# EasyEDA Pro project Cat01高低温NI板.eprj, board PCB1
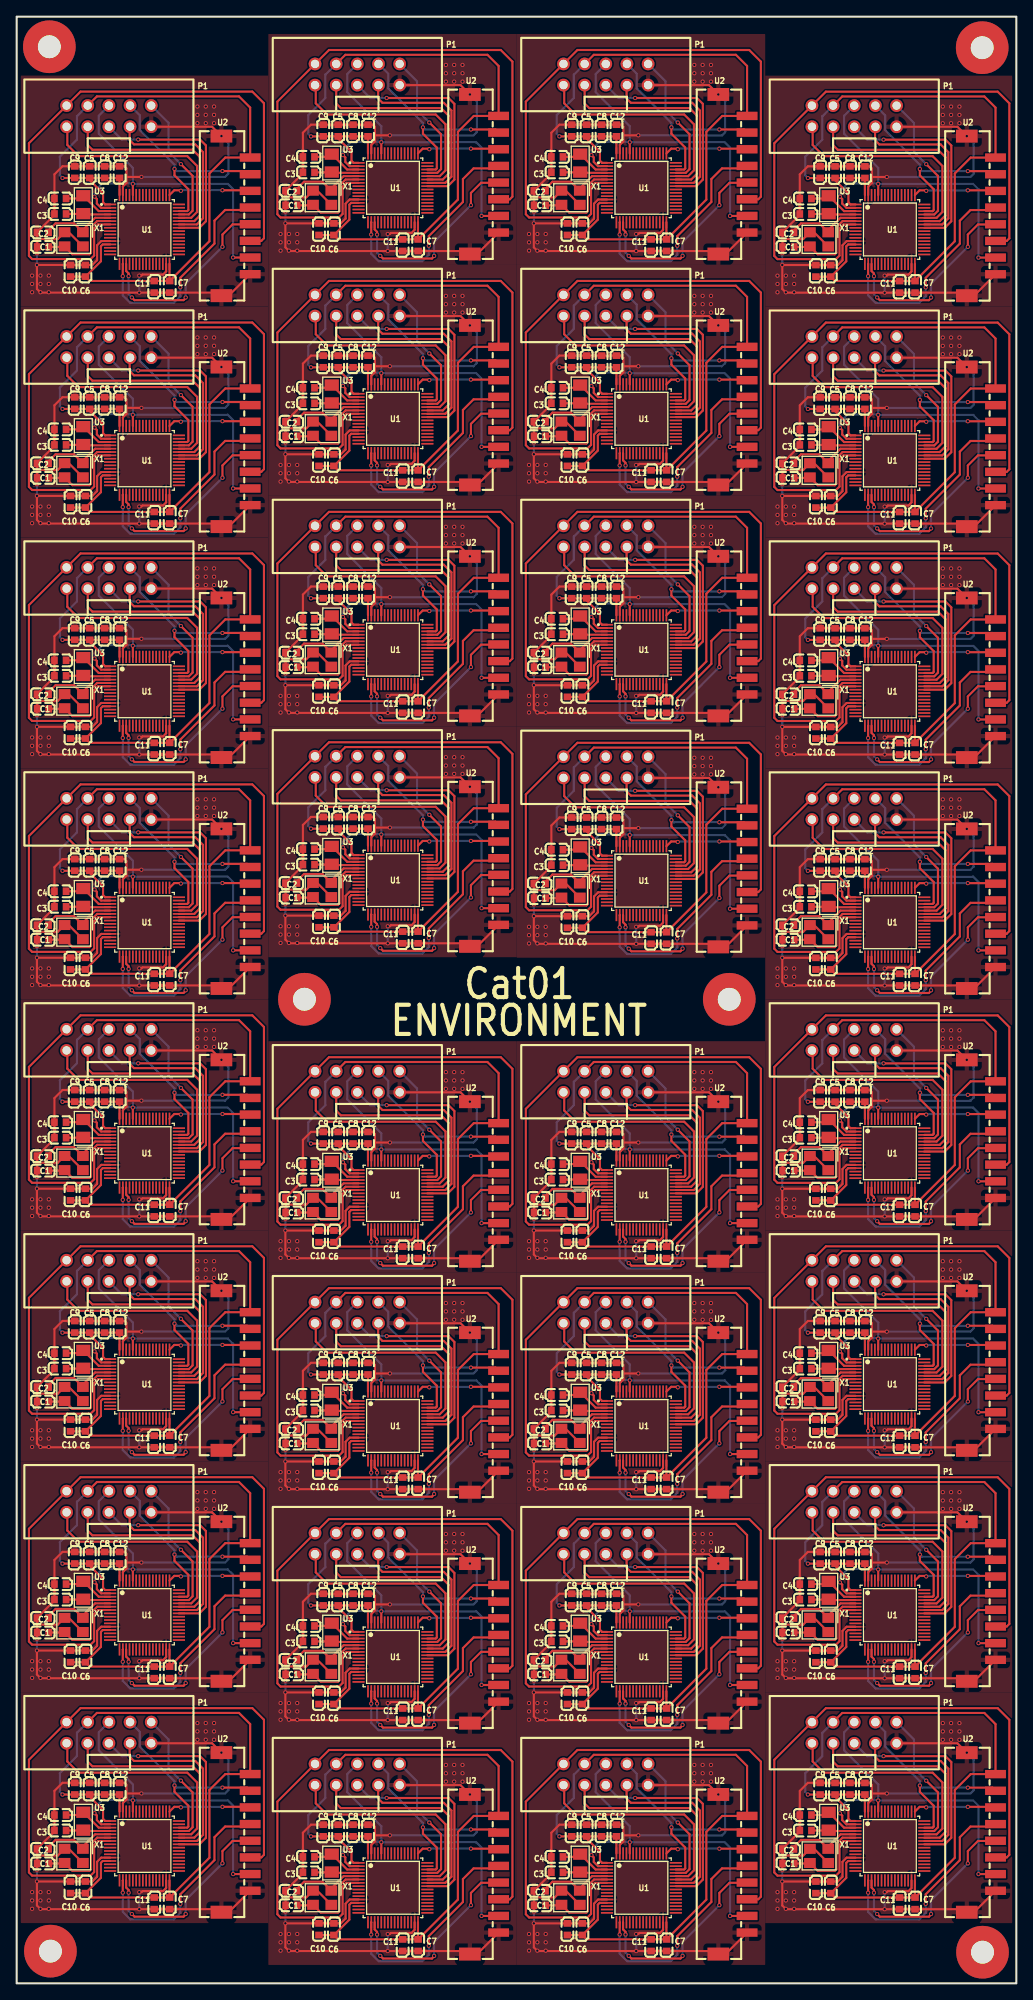
[diagram p1: board, top side]
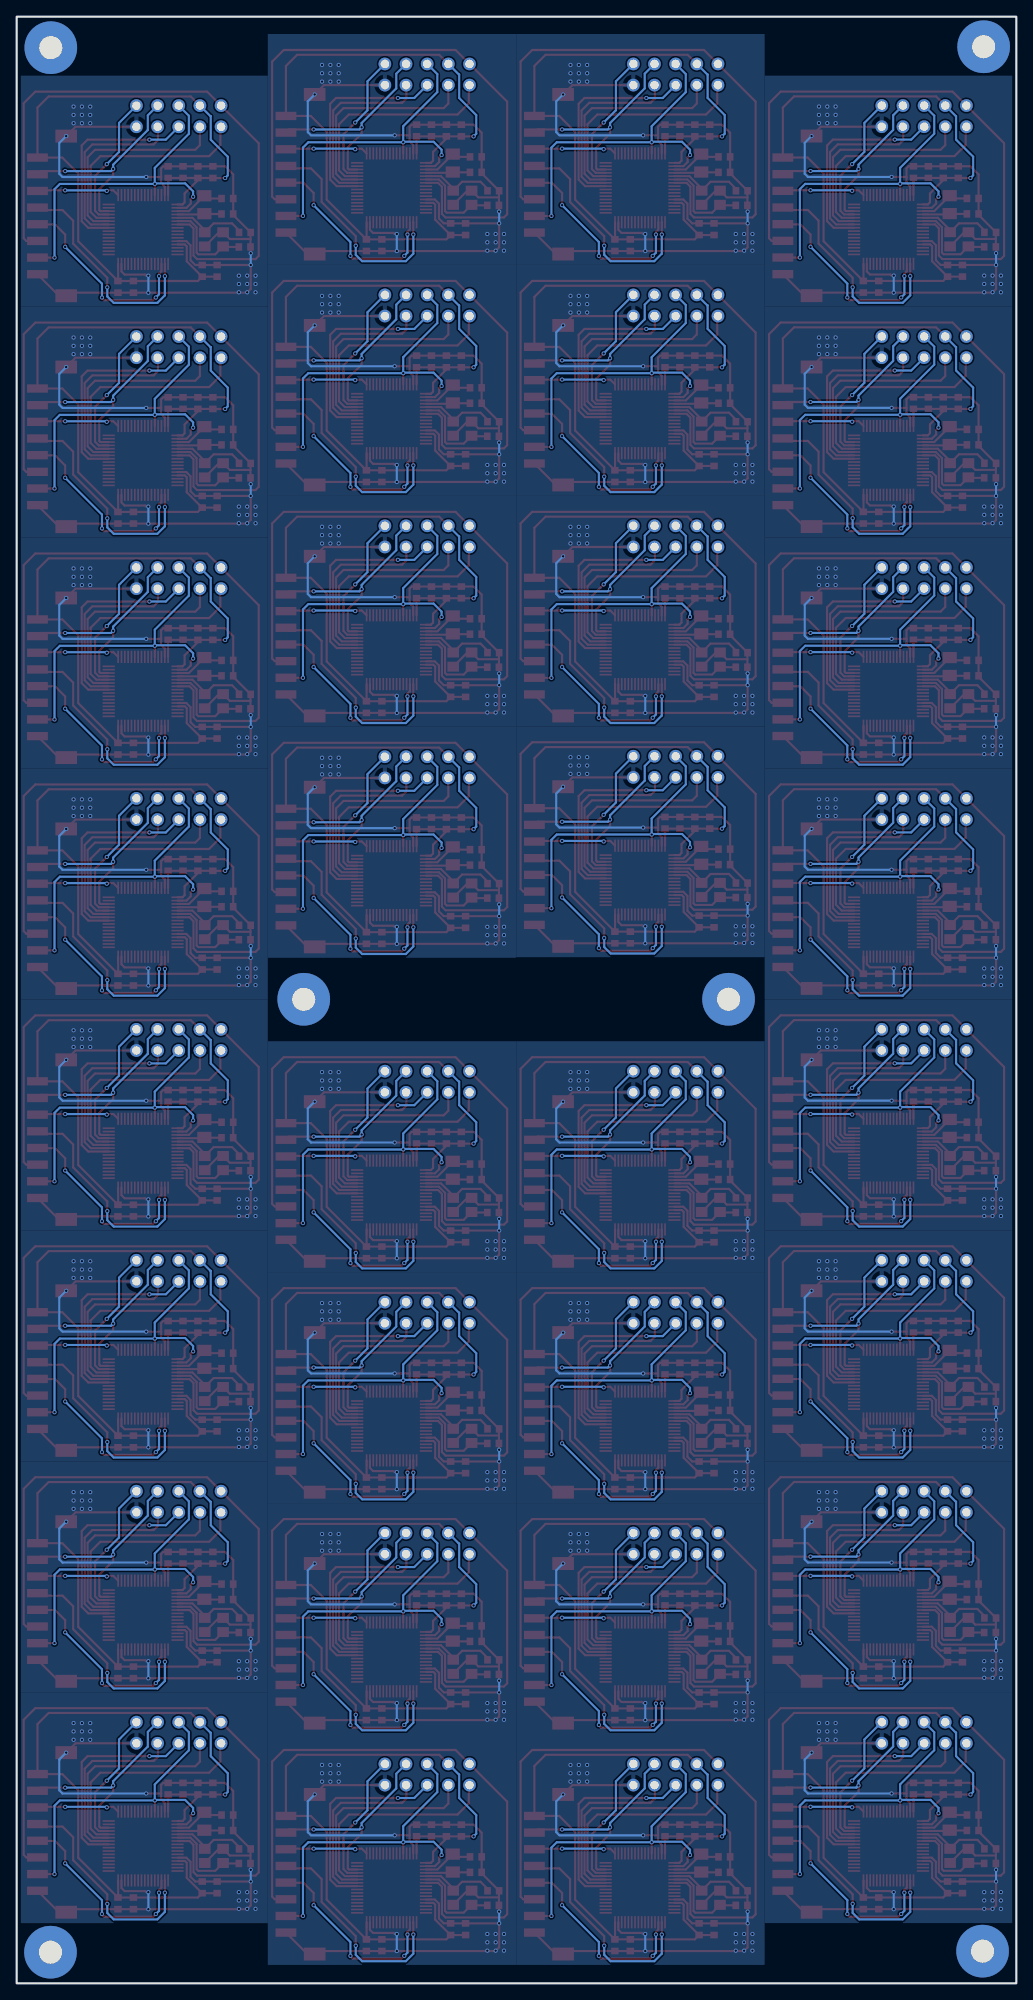
[diagram p2: board, bottom side, seen from below]

Outline 120 x 236 mm; copper layers: Top Layer, Bottom Layer. Coordinates in mm from the lower left corner of the outline.
Outline path: rectangle 0,236 120,0
Stack: Top Layer 0.035mm / Dielectric1 1.51mm FR4 er 4.5 / Bottom Layer 0.035mm

## Design rules (mm)
template: 自定义配置
spacing copperThickness1oz (default): track to track 0.102, other pairs 0.152 to 0.3
spacing copperThickness2oz: track to track 0.203, other pairs 0.152 to 0.3
track width copperThickness1oz (default): min 0.127, default 0.254, max 2.54
track width copperThickness2oz: min 0.203, default 0.254, max 2.54
differential pair differentialPair (default): width min 0.127, default 0.254, max 2.54; gap min 0.152, default 0.152
via viaSize (default): diameter min 0.5, default 0.61, max 10; hole min 0.3, default 0.305, max 6.3

## Placement (name value [footprint] x y rotation side)
C1  12pF  [C0603]  62.81 9.36 0 top
C1#2  -  [C0603]  92.63 208.36 0 top
C1#3  -  [C0603]  92.63 180.65 0 top
C1#4  -  [C0603]  92.63 152.94 0 top
C1#5  -  [C0603]  3.16 180.66 0 top
C1#6  -  [C0603]  92.63 125.23 0 top
C1#7  -  [C0603]  92.63 97.52 0 top
C1#8  -  [C0603]  92.63 69.81 0 top
C1#9  -  [C0603]  92.63 42.09 0 top
C1#10  -  [C0603]  92.63 14.38 0 top
C1#11  -  [C0603]  3.16 152.95 0 top
C1#12  -  [C0603]  3.16 208.37 0 top
C1#13  -  [C0603]  3.16 125.23 0 top
C1#14  -  [C0603]  3.16 97.52 0 top
C1#15  -  [C0603]  3.16 69.81 0 top
C1#16  -  [C0603]  3.16 42.1 0 top
C1#17  -  [C0603]  3.16 14.39 0 top
C1#18  -  [C0603]  32.98 92.5 0 top
C1#19  -  [C0603]  32.98 130.29 0 top
C1#20  -  [C0603]  32.98 64.79 0 top
C1#21  -  [C0603]  32.98 37.07 0 top
C1#22  -  [C0603]  32.98 9.36 0 top
C1#23  -  [C0603]  32.98 213.36 0 top
C1#24  -  [C0603]  32.98 185.65 0 top
C1#25  -  [C0603]  32.98 157.94 0 top
C1#26  -  [C0603]  62.81 213.36 0 top
C1#27  -  [C0603]  62.81 185.65 0 top
C1#28  -  [C0603]  62.81 157.94 0 top
C1#29  -  [C0603]  62.81 130.23 0 top
C1#30  -  [C0603]  62.81 92.5 0 top
C1#31  -  [C0603]  62.81 64.79 0 top
C1#32  -  [C0603]  62.81 37.07 0 top
C2  12pF  [C0603]  62.78 11.1 180 top
C2#2  -  [C0603]  92.61 210.11 180 top
C2#3  -  [C0603]  92.61 182.39 180 top
C2#4  -  [C0603]  92.61 154.68 180 top
C2#5  -  [C0603]  92.61 126.97 180 top
C2#6  -  [C0603]  3.14 182.4 180 top
C2#7  -  [C0603]  92.61 99.26 180 top
C2#8  -  [C0603]  92.61 71.55 180 top
C2#9  -  [C0603]  92.61 43.84 180 top
C2#10  -  [C0603]  92.61 16.12 180 top
C2#11  -  [C0603]  3.14 154.69 180 top
C2#12  -  [C0603]  3.14 210.11 180 top
C2#13  -  [C0603]  3.14 126.98 180 top
C2#14  -  [C0603]  3.14 99.26 180 top
C2#15  -  [C0603]  3.14 71.55 180 top
C2#16  -  [C0603]  3.14 43.84 180 top
C2#17  -  [C0603]  3.14 16.13 180 top
C2#18  -  [C0603]  32.96 94.24 180 top
C2#19  -  [C0603]  32.96 132.03 180 top
C2#20  -  [C0603]  32.96 66.53 180 top
C2#21  -  [C0603]  32.96 38.82 180 top
C2#22  -  [C0603]  32.96 11.1 180 top
C2#23  -  [C0603]  32.96 215.1 180 top
C2#24  -  [C0603]  32.96 187.39 180 top
C2#25  -  [C0603]  32.96 159.68 180 top
C2#26  -  [C0603]  62.78 215.1 180 top
C2#27  -  [C0603]  62.78 187.39 180 top
C2#28  -  [C0603]  62.78 159.68 180 top
C2#29  -  [C0603]  62.78 131.97 180 top
C2#30  -  [C0603]  62.78 94.24 180 top
C2#31  -  [C0603]  62.78 66.53 180 top
C2#32  -  [C0603]  62.78 38.82 180 top
C3  18pF  [C0603]  64.88 13.32 180 top
C3#2  -  [C0603]  94.71 212.32 180 top
C3#3  -  [C0603]  94.71 184.61 180 top
C3#4  -  [C0603]  94.71 156.9 180 top
C3#5  -  [C0603]  5.23 184.62 180 top
C3#6  -  [C0603]  94.71 129.19 180 top
C3#7  -  [C0603]  94.71 101.47 180 top
C3#8  -  [C0603]  94.71 73.76 180 top
C3#9  -  [C0603]  94.71 46.05 180 top
C3#10  -  [C0603]  94.71 18.34 180 top
C3#11  -  [C0603]  5.23 156.9 180 top
C3#12  -  [C0603]  5.23 212.33 180 top
C3#13  -  [C0603]  5.23 129.19 180 top
C3#14  -  [C0603]  5.23 101.48 180 top
C3#15  -  [C0603]  5.23 73.77 180 top
C3#16  -  [C0603]  5.23 46.06 180 top
C3#17  -  [C0603]  5.23 18.34 180 top
C3#18  -  [C0603]  35.06 96.46 180 top
C3#19  -  [C0603]  35.06 134.25 180 top
C3#20  -  [C0603]  35.06 68.74 180 top
C3#21  -  [C0603]  35.06 41.03 180 top
C3#22  -  [C0603]  35.06 13.32 180 top
C3#23  -  [C0603]  35.06 217.32 180 top
C3#24  -  [C0603]  35.06 189.61 180 top
C3#25  -  [C0603]  35.06 161.9 180 top
C3#26  -  [C0603]  64.88 217.32 180 top
C3#27  -  [C0603]  64.88 189.61 180 top
C3#28  -  [C0603]  64.88 161.9 180 top
C3#29  -  [C0603]  64.88 134.18 180 top
C3#30  -  [C0603]  64.88 96.46 180 top
C3#31  -  [C0603]  64.88 68.74 180 top
C3#32  -  [C0603]  64.88 41.03 180 top
C4  18pF  [C0603]  64.88 15.18 180 top
C4#2  -  [C0603]  94.7 214.18 180 top
C4#3  -  [C0603]  94.7 186.47 180 top
C4#4  -  [C0603]  94.7 158.75 180 top
C4#5  -  [C0603]  5.23 186.47 180 top
C4#6  -  [C0603]  94.7 131.04 180 top
C4#7  -  [C0603]  94.7 103.33 180 top
C4#8  -  [C0603]  94.7 75.62 180 top
C4#9  -  [C0603]  94.7 47.91 180 top
C4#10  -  [C0603]  94.7 20.2 180 top
C4#11  -  [C0603]  5.23 158.76 180 top
C4#12  -  [C0603]  5.23 214.18 180 top
C4#13  -  [C0603]  5.23 131.05 180 top
C4#14  -  [C0603]  5.23 103.34 180 top
C4#15  -  [C0603]  5.23 75.62 180 top
C4#16  -  [C0603]  5.23 47.91 180 top
C4#17  -  [C0603]  5.23 20.2 180 top
C4#18  -  [C0603]  35.06 98.31 180 top
C4#19  -  [C0603]  35.06 136.1 180 top
C4#20  -  [C0603]  35.06 70.6 180 top
C4#21  -  [C0603]  35.06 42.89 180 top
C4#22  -  [C0603]  35.06 15.18 180 top
C4#23  -  [C0603]  35.06 219.18 180 top
C4#24  -  [C0603]  35.06 191.46 180 top
C4#25  -  [C0603]  35.06 163.75 180 top
C4#26  -  [C0603]  64.88 219.18 180 top
C4#27  -  [C0603]  64.88 191.46 180 top
C4#28  -  [C0603]  64.88 163.75 180 top
C4#29  -  [C0603]  64.88 136.04 180 top
C4#30  -  [C0603]  64.88 98.31 180 top
C4#31  -  [C0603]  64.88 70.6 180 top
C4#32  -  [C0603]  64.88 42.89 180 top
C5  100nF  [C0603]  8.77 217.34 90 top
C5#2  -  [C0603]  68.42 18.34 90 top
C5#3  -  [C0603]  98.24 217.34 90 top
C5#4  -  [C0603]  8.77 189.63 90 top
C5#5  -  [C0603]  98.24 189.63 90 top
C5#6  -  [C0603]  98.24 161.91 90 top
C5#7  -  [C0603]  98.24 134.2 90 top
C5#8  -  [C0603]  98.24 106.49 90 top
C5#9  -  [C0603]  98.24 78.78 90 top
C5#10  -  [C0603]  98.24 51.07 90 top
C5#11  -  [C0603]  98.24 23.36 90 top
C5#12  -  [C0603]  8.77 161.92 90 top
C5#13  -  [C0603]  8.77 134.21 90 top
C5#14  -  [C0603]  8.77 106.5 90 top
C5#15  -  [C0603]  8.77 78.78 90 top
C5#16  -  [C0603]  8.77 51.07 90 top
C5#17  -  [C0603]  8.77 23.36 90 top
C5#18  -  [C0603]  38.59 101.47 90 top
C5#19  -  [C0603]  38.59 139.26 90 top
C5#20  -  [C0603]  38.59 73.76 90 top
C5#21  -  [C0603]  38.59 46.05 90 top
C5#22  -  [C0603]  38.59 18.34 90 top
C5#23  -  [C0603]  38.59 222.34 90 top
C5#24  -  [C0603]  38.59 194.62 90 top
C5#25  -  [C0603]  38.59 166.91 90 top
C5#26  -  [C0603]  68.42 222.34 90 top
C5#27  -  [C0603]  68.42 194.62 90 top
C5#28  -  [C0603]  68.42 166.91 90 top
C5#29  -  [C0603]  68.42 139.2 90 top
C5#30  -  [C0603]  68.42 101.47 90 top
C5#31  -  [C0603]  68.42 73.76 90 top
C5#32  -  [C0603]  68.42 46.05 90 top
C6  100nF  [C0603]  8.26 205.5 270 top
C6#2  -  [C0603]  67.9 6.5 270 top
C6#3  -  [C0603]  97.73 205.5 270 top
C6#4  -  [C0603]  97.73 177.79 270 top
C6#5  -  [C0603]  97.73 150.07 270 top
C6#6  -  [C0603]  97.73 122.36 270 top
C6#7  -  [C0603]  97.73 94.65 270 top
C6#8  -  [C0603]  8.26 177.79 270 top
C6#9  -  [C0603]  97.73 66.94 270 top
C6#10  -  [C0603]  97.73 39.23 270 top
C6#11  -  [C0603]  97.73 11.52 270 top
C6#12  -  [C0603]  8.26 150.08 270 top
C6#13  -  [C0603]  8.26 122.37 270 top
C6#14  -  [C0603]  8.26 94.66 270 top
C6#15  -  [C0603]  8.26 66.94 270 top
C6#16  -  [C0603]  8.26 39.23 270 top
C6#17  -  [C0603]  8.26 11.52 270 top
C6#18  -  [C0603]  38.08 89.63 270 top
C6#19  -  [C0603]  38.08 127.42 270 top
C6#20  -  [C0603]  38.08 61.92 270 top
C6#21  -  [C0603]  38.08 34.21 270 top
C6#22  -  [C0603]  38.08 6.5 270 top
C6#23  -  [C0603]  38.08 210.5 270 top
C6#24  -  [C0603]  38.08 182.78 270 top
C6#25  -  [C0603]  38.08 155.07 270 top
C6#26  -  [C0603]  67.9 210.5 270 top
C6#27  -  [C0603]  67.9 182.78 270 top
C6#28  -  [C0603]  67.9 155.07 270 top
C6#29  -  [C0603]  67.9 127.36 270 top
C6#30  -  [C0603]  67.9 89.63 270 top
C6#31  -  [C0603]  67.9 61.92 270 top
C6#32  -  [C0603]  67.9 34.21 270 top
C7  100nF  [C0603]  18.37 92.74 270 top
C7#2  -  [C0603]  78.02 4.58 270 top
C7#3  -  [C0603]  107.84 203.58 270 top
C7#4  -  [C0603]  107.84 175.87 270 top
C7#5  -  [C0603]  107.84 148.15 270 top
C7#6  -  [C0603]  107.84 120.44 270 top
C7#7  -  [C0603]  107.84 92.73 270 top
C7#8  -  [C0603]  107.84 65.02 270 top
C7#9  -  [C0603]  107.84 37.31 270 top
C7#10  -  [C0603]  107.84 9.6 270 top
C7#11  -  [C0603]  18.37 148.16 270 top
C7#12  -  [C0603]  18.37 203.58 270 top
C7#13  -  [C0603]  18.37 120.45 270 top
C7#14  -  [C0603]  18.37 65.02 270 top
C7#15  -  [C0603]  18.37 37.31 270 top
C7#16  -  [C0603]  18.37 9.6 270 top
C7#17  -  [C0603]  48.19 87.71 270 top
C7#18  -  [C0603]  48.19 125.5 270 top
C7#19  -  [C0603]  48.19 60 270 top
C7#20  -  [C0603]  48.19 32.29 270 top
C7#21  -  [C0603]  48.19 4.58 270 top
C7#22  -  [C0603]  48.19 208.58 270 top
C7#23  -  [C0603]  48.19 180.86 270 top
C7#24  -  [C0603]  48.19 153.15 270 top
C7#25  -  [C0603]  78.02 208.58 270 top
C7#26  -  [C0603]  78.02 180.86 270 top
C7#27  -  [C0603]  78.02 153.15 270 top
C7#28  -  [C0603]  78.02 125.44 270 top
C7#29  -  [C0603]  78.02 87.71 270 top
C7#30  -  [C0603]  78.02 60 270 top
C7#31  -  [C0603]  18.37 175.87 270 top
C7#32  -  [C0603]  78.02 32.29 270 top
C8  100nF  [C0603]  70.21 18.34 270 top
C8#2  -  [C0603]  100.03 217.34 270 top
C8#3  -  [C0603]  100.03 189.63 270 top
C8#4  -  [C0603]  100.03 161.91 270 top
C8#5  -  [C0603]  100.03 134.2 270 top
C8#6  -  [C0603]  10.56 189.63 270 top
C8#7  -  [C0603]  100.03 106.49 270 top
C8#8  -  [C0603]  100.03 78.78 270 top
C8#9  -  [C0603]  100.03 51.07 270 top
C8#10  -  [C0603]  100.03 23.36 270 top
C8#11  -  [C0603]  10.56 161.92 270 top
C8#12  -  [C0603]  10.56 217.34 270 top
C8#13  -  [C0603]  10.56 134.21 270 top
C8#14  -  [C0603]  10.56 106.5 270 top
C8#15  -  [C0603]  10.56 78.78 270 top
C8#16  -  [C0603]  10.56 51.07 270 top
C8#17  -  [C0603]  10.56 23.36 270 top
C8#18  -  [C0603]  40.38 101.47 270 top
C8#19  -  [C0603]  40.38 139.26 270 top
C8#20  -  [C0603]  40.38 73.76 270 top
C8#21  -  [C0603]  40.38 46.05 270 top
C8#22  -  [C0603]  40.38 18.34 270 top
C8#23  -  [C0603]  40.38 222.34 270 top
C8#24  -  [C0603]  40.38 194.62 270 top
C8#25  -  [C0603]  40.38 166.91 270 top
C8#26  -  [C0603]  70.21 222.34 270 top
C8#27  -  [C0603]  70.21 194.62 270 top
C8#28  -  [C0603]  70.21 166.91 270 top
C8#29  -  [C0603]  70.21 139.2 270 top
C8#30  -  [C0603]  70.21 101.47 270 top
C8#31  -  [C0603]  70.21 73.76 270 top
C8#32  -  [C0603]  70.21 46.05 270 top
C9  10uF  [C0603]  66.62 18.34 90 top
C9#2  -  [C0603]  96.45 217.34 90 top
C9#3  -  [C0603]  96.45 189.63 90 top
C9#4  -  [C0603]  6.98 189.63 90 top
C9#5  -  [C0603]  96.45 161.91 90 top
C9#6  -  [C0603]  96.45 134.2 90 top
C9#7  -  [C0603]  96.45 106.49 90 top
C9#8  -  [C0603]  96.45 78.78 90 top
C9#9  -  [C0603]  96.45 51.07 90 top
C9#10  -  [C0603]  96.45 23.36 90 top
C9#11  -  [C0603]  6.98 161.92 90 top
C9#12  -  [C0603]  6.98 217.34 90 top
C9#13  -  [C0603]  6.98 134.21 90 top
C9#14  -  [C0603]  6.98 106.5 90 top
C9#15  -  [C0603]  6.98 78.78 90 top
C9#16  -  [C0603]  6.98 51.07 90 top
C9#17  -  [C0603]  6.98 23.36 90 top
C9#18  -  [C0603]  36.8 101.47 90 top
C9#19  -  [C0603]  36.8 139.26 90 top
C9#20  -  [C0603]  36.8 73.76 90 top
C9#21  -  [C0603]  36.8 46.05 90 top
C9#22  -  [C0603]  36.8 18.34 90 top
C9#23  -  [C0603]  36.8 222.34 90 top
C9#24  -  [C0603]  36.8 194.62 90 top
C9#25  -  [C0603]  36.8 166.91 90 top
C9#26  -  [C0603]  66.62 222.34 90 top
C9#27  -  [C0603]  66.62 194.62 90 top
C9#28  -  [C0603]  66.62 166.91 90 top
C9#29  -  [C0603]  66.62 139.2 90 top
C9#30  -  [C0603]  66.62 101.47 90 top
C9#31  -  [C0603]  66.62 73.76 90 top
C9#32  -  [C0603]  66.62 46.05 90 top
C10  10uF  [C0603]  66.11 6.5 270 top
C10#2  -  [C0603]  95.94 205.5 270 top
C10#3  -  [C0603]  95.94 177.79 270 top
C10#4  -  [C0603]  95.94 150.07 270 top
C10#5  -  [C0603]  95.94 122.36 270 top
C10#6  -  [C0603]  95.94 94.65 270 top
C10#7  -  [C0603]  6.46 177.79 270 top
C10#8  -  [C0603]  95.94 66.94 270 top
C10#9  -  [C0603]  95.94 39.23 270 top
C10#10  -  [C0603]  95.94 11.52 270 top
C10#11  -  [C0603]  6.46 205.5 270 top
C10#12  -  [C0603]  6.46 150.08 270 top
C10#13  -  [C0603]  6.46 122.37 270 top
C10#14  -  [C0603]  6.46 94.66 270 top
C10#15  -  [C0603]  6.46 66.94 270 top
C10#16  -  [C0603]  6.46 39.23 270 top
C10#17  -  [C0603]  6.46 11.52 270 top
C10#18  -  [C0603]  36.29 89.63 270 top
C10#19  -  [C0603]  36.29 127.42 270 top
C10#20  -  [C0603]  36.29 61.92 270 top
C10#21  -  [C0603]  36.29 34.21 270 top
C10#22  -  [C0603]  36.29 6.5 270 top
C10#23  -  [C0603]  36.29 210.5 270 top
C10#24  -  [C0603]  36.29 182.78 270 top
C10#25  -  [C0603]  36.29 155.07 270 top
C10#26  -  [C0603]  66.11 210.5 270 top
C10#27  -  [C0603]  66.11 182.78 270 top
C10#28  -  [C0603]  66.11 155.07 270 top
C10#29  -  [C0603]  66.11 127.36 270 top
C10#30  -  [C0603]  66.11 89.63 270 top
C10#31  -  [C0603]  66.11 61.92 270 top
C10#32  -  [C0603]  66.11 34.21 270 top
C11  10uF  [C0603]  16.51 92.74 270 top
C11#2  -  [C0603]  76.16 4.58 270 top
C11#3  -  [C0603]  105.98 203.58 270 top
C11#4  -  [C0603]  105.98 175.87 270 top
C11#5  -  [C0603]  105.98 148.15 270 top
C11#6  -  [C0603]  105.98 120.44 270 top
C11#7  -  [C0603]  105.98 92.73 270 top
C11#8  -  [C0603]  105.98 65.02 270 top
C11#9  -  [C0603]  105.98 37.31 270 top
C11#10  -  [C0603]  105.98 9.6 270 top
C11#11  -  [C0603]  16.51 148.16 270 top
C11#12  -  [C0603]  16.51 203.58 270 top
C11#13  -  [C0603]  16.51 120.45 270 top
C11#14  -  [C0603]  16.51 65.02 270 top
C11#15  -  [C0603]  16.51 37.31 270 top
C11#16  -  [C0603]  16.51 9.6 270 top
C11#17  -  [C0603]  46.34 87.71 270 top
C11#18  -  [C0603]  46.34 125.5 270 top
C11#19  -  [C0603]  46.34 60 270 top
C11#20  -  [C0603]  46.34 32.29 270 top
C11#21  -  [C0603]  46.34 4.58 270 top
C11#22  -  [C0603]  46.34 208.58 270 top
C11#23  -  [C0603]  46.34 180.86 270 top
C11#24  -  [C0603]  46.34 153.15 270 top
C11#25  -  [C0603]  76.16 208.58 270 top
C11#26  -  [C0603]  76.16 180.86 270 top
C11#27  -  [C0603]  76.16 153.15 270 top
C11#28  -  [C0603]  76.16 125.44 270 top
C11#29  -  [C0603]  76.16 87.71 270 top
C11#30  -  [C0603]  76.16 60 270 top
C11#31  -  [C0603]  16.51 175.87 270 top
C11#32  -  [C0603]  76.16 32.29 270 top
C12  10uF  [C0603]  72 18.34 270 top
C12#2  -  [C0603]  101.82 217.34 270 top
C12#3  -  [C0603]  101.82 189.63 270 top
C12#4  -  [C0603]  101.82 161.91 270 top
C12#5  -  [C0603]  101.82 134.2 270 top
C12#6  -  [C0603]  12.35 189.63 270 top
C12#7  -  [C0603]  101.82 106.49 270 top
C12#8  -  [C0603]  101.82 78.78 270 top
C12#9  -  [C0603]  101.82 51.07 270 top
C12#10  -  [C0603]  101.82 23.36 270 top
C12#11  -  [C0603]  12.35 217.34 270 top
C12#12  -  [C0603]  12.35 161.92 270 top
C12#13  -  [C0603]  12.35 134.21 270 top
C12#14  -  [C0603]  12.35 106.5 270 top
C12#15  -  [C0603]  12.35 78.78 270 top
C12#16  -  [C0603]  12.35 51.07 270 top
C12#17  -  [C0603]  12.35 23.36 270 top
C12#18  -  [C0603]  42.18 101.47 270 top
C12#19  -  [C0603]  42.18 139.26 270 top
C12#20  -  [C0603]  42.18 73.76 270 top
C12#21  -  [C0603]  42.18 46.05 270 top
C12#22  -  [C0603]  42.18 18.34 270 top
C12#23  -  [C0603]  42.18 222.34 270 top
C12#24  -  [C0603]  42.18 194.62 270 top
C12#25  -  [C0603]  42.18 166.91 270 top
C12#26  -  [C0603]  72 222.34 270 top
C12#27  -  [C0603]  72 194.62 270 top
C12#28  -  [C0603]  72 166.91 270 top
C12#29  -  [C0603]  72 139.2 270 top
C12#30  -  [C0603]  72 101.47 270 top
C12#31  -  [C0603]  72 73.76 270 top
C12#32  -  [C0603]  72 46.05 270 top
J1  -  [demo板安装孔]  34.55 118.09 0 top
J2  -  [demo板安装孔]  85.54 118.09 0 top
J3  -  [demo板安装孔]  3.92 232.39 0 top
J4  -  [demo板安装孔]  115.9 232.28 0 top
J5  -  [demo板安装孔]  115.94 3.73 0 top
J6  -  [demo板安装孔]  4.05 3.86 0 top
P1  2.54-2*5P简牛  [IDC-TH_10P-P2.54_C5665]  11.07 113.22 0 top
P1#2  -  [IDC-TH_10P-P2.54_C5665]  70.72 25.06 0 top
P1#3  -  [IDC-TH_10P-P2.54_C5665]  100.54 224.06 0 top
P1#4  -  [IDC-TH_10P-P2.54_C5665]  100.54 196.35 0 top
P1#5  -  [IDC-TH_10P-P2.54_C5665]  100.54 168.63 0 top
P1#6  -  [IDC-TH_10P-P2.54_C5665]  100.54 140.92 0 top
P1#7  -  [IDC-TH_10P-P2.54_C5665]  100.54 113.21 0 top
P1#8  -  [IDC-TH_10P-P2.54_C5665]  100.54 85.5 0 top
P1#9  -  [IDC-TH_10P-P2.54_C5665]  100.54 57.79 0 top
P1#10  -  [IDC-TH_10P-P2.54_C5665]  100.54 30.08 0 top
P1#11  -  [IDC-TH_10P-P2.54_C5665]  11.07 168.64 0 top
P1#12  -  [IDC-TH_10P-P2.54_C5665]  11.07 224.06 0 top
P1#13  -  [IDC-TH_10P-P2.54_C5665]  11.07 140.93 0 top
P1#14  -  [IDC-TH_10P-P2.54_C5665]  11.07 85.5 0 top
P1#15  -  [IDC-TH_10P-P2.54_C5665]  11.07 57.79 0 top
P1#16  -  [IDC-TH_10P-P2.54_C5665]  11.07 30.08 0 top
P1#17  -  [IDC-TH_10P-P2.54_C5665]  40.9 108.19 0 top
P1#18  -  [IDC-TH_10P-P2.54_C5665]  40.9 145.98 0 top
P1#19  -  [IDC-TH_10P-P2.54_C5665]  40.9 80.48 0 top
P1#20  -  [IDC-TH_10P-P2.54_C5665]  40.9 52.77 0 top
P1#21  -  [IDC-TH_10P-P2.54_C5665]  40.9 25.06 0 top
P1#22  -  [IDC-TH_10P-P2.54_C5665]  40.9 229.06 0 top
P1#23  -  [IDC-TH_10P-P2.54_C5665]  40.9 201.34 0 top
P1#24  -  [IDC-TH_10P-P2.54_C5665]  40.9 173.63 0 top
P1#25  -  [IDC-TH_10P-P2.54_C5665]  70.72 229.06 0 top
P1#26  -  [IDC-TH_10P-P2.54_C5665]  70.72 201.34 0 top
P1#27  -  [IDC-TH_10P-P2.54_C5665]  70.72 173.63 0 top
P1#28  -  [IDC-TH_10P-P2.54_C5665]  70.72 145.92 0 top
P1#29  -  [IDC-TH_10P-P2.54_C5665]  70.72 108.19 0 top
P1#30  -  [IDC-TH_10P-P2.54_C5665]  70.72 80.48 0 top
P1#31  -  [IDC-TH_10P-P2.54_C5665]  70.72 52.77 0 top
P1#32  -  [IDC-TH_10P-P2.54_C5665]  11.07 196.35 0 top
U1  -  [LQFP-64_L7.0-W7.0-P0.40-LS9.0-TL]  75 11.46 0 top
U1#2  -  [LQFP-64_L7.0-W7.0-P0.40-LS9.0-TL]  104.82 210.46 0 top
U1#3  -  [LQFP-64_L7.0-W7.0-P0.40-LS9.0-TL]  104.82 182.75 0 top
U1#4  -  [LQFP-64_L7.0-W7.0-P0.40-LS9.0-TL]  15.35 182.76 0 top
U1#5  -  [LQFP-64_L7.0-W7.0-P0.40-LS9.0-TL]  104.82 155.04 0 top
U1#6  -  [LQFP-64_L7.0-W7.0-P0.40-LS9.0-TL]  104.82 127.33 0 top
U1#7  -  [LQFP-64_L7.0-W7.0-P0.40-LS9.0-TL]  104.82 99.61 0 top
U1#8  -  [LQFP-64_L7.0-W7.0-P0.40-LS9.0-TL]  104.82 71.9 0 top
U1#9  -  [LQFP-64_L7.0-W7.0-P0.40-LS9.0-TL]  15.35 44.2 0 top
U1#10  -  [LQFP-64_L7.0-W7.0-P0.40-LS9.0-TL]  104.82 44.19 0 top
U1#11  -  [LQFP-64_L7.0-W7.0-P0.40-LS9.0-TL]  104.82 16.48 0 top
U1#12  -  [LQFP-64_L7.0-W7.0-P0.40-LS9.0-TL]  15.35 155.04 0 top
U1#13  -  [LQFP-64_L7.0-W7.0-P0.40-LS9.0-TL]  15.35 210.47 0 top
U1#14  -  [LQFP-64_L7.0-W7.0-P0.40-LS9.0-TL]  15.35 127.33 0 top
U1#15  -  [LQFP-64_L7.0-W7.0-P0.40-LS9.0-TL]  15.35 99.62 0 top
U1#16  -  [LQFP-64_L7.0-W7.0-P0.40-LS9.0-TL]  15.35 71.91 0 top
U1#17  -  [LQFP-64_L7.0-W7.0-P0.40-LS9.0-TL]  15.35 16.48 0 top
U1#18  -  [LQFP-64_L7.0-W7.0-P0.40-LS9.0-TL]  45.17 94.6 0 top
U1#19  -  [LQFP-64_L7.0-W7.0-P0.40-LS9.0-TL]  45.17 132.39 0 top
U1#20  -  [LQFP-64_L7.0-W7.0-P0.40-LS9.0-TL]  45.17 66.88 0 top
U1#21  -  [LQFP-64_L7.0-W7.0-P0.40-LS9.0-TL]  45.17 39.17 0 top
U1#22  -  [LQFP-64_L7.0-W7.0-P0.40-LS9.0-TL]  45.17 11.46 0 top
U1#23  -  [LQFP-64_L7.0-W7.0-P0.40-LS9.0-TL]  45.17 215.46 0 top
U1#24  -  [LQFP-64_L7.0-W7.0-P0.40-LS9.0-TL]  45.17 187.75 0 top
U1#25  -  [LQFP-64_L7.0-W7.0-P0.40-LS9.0-TL]  45.17 160.04 0 top
U1#26  -  [LQFP-64_L7.0-W7.0-P0.40-LS9.0-TL]  75 215.46 0 top
U1#27  -  [LQFP-64_L7.0-W7.0-P0.40-LS9.0-TL]  75 187.75 0 top
U1#28  -  [LQFP-64_L7.0-W7.0-P0.40-LS9.0-TL]  75 160.04 0 top
U1#29  -  [LQFP-64_L7.0-W7.0-P0.40-LS9.0-TL]  75 132.32 0 top
U1#30  -  [LQFP-64_L7.0-W7.0-P0.40-LS9.0-TL]  75 94.6 0 top
U1#31  -  [LQFP-64_L7.0-W7.0-P0.40-LS9.0-TL]  75 66.88 0 top
U1#32  -  [LQFP-64_L7.0-W7.0-P0.40-LS9.0-TL]  75 39.17 0 top
U2  A2008WV-S-8P  [CONN-SMD_A2008WV-S-8P]  26.3 184.38 270 top
U2#2  -  [CONN-SMD_A2008WV-S-8P]  85.95 13.09 270 top
U2#3  -  [CONN-SMD_A2008WV-S-8P]  115.78 212.09 270 top
U2#4  -  [CONN-SMD_A2008WV-S-8P]  115.78 184.38 270 top
U2#5  -  [CONN-SMD_A2008WV-S-8P]  115.78 156.67 270 top
U2#6  -  [CONN-SMD_A2008WV-S-8P]  115.78 128.95 270 top
U2#7  -  [CONN-SMD_A2008WV-S-8P]  115.78 101.24 270 top
U2#8  -  [CONN-SMD_A2008WV-S-8P]  115.78 73.53 270 top
U2#9  -  [CONN-SMD_A2008WV-S-8P]  115.78 45.82 270 top
U2#10  -  [CONN-SMD_A2008WV-S-8P]  115.78 18.11 270 top
U2#11  -  [CONN-SMD_A2008WV-S-8P]  26.3 156.67 270 top
U2#12  -  [CONN-SMD_A2008WV-S-8P]  26.3 212.1 270 top
U2#13  -  [CONN-SMD_A2008WV-S-8P]  26.3 128.96 270 top
U2#14  -  [CONN-SMD_A2008WV-S-8P]  26.3 101.25 270 top
U2#15  -  [CONN-SMD_A2008WV-S-8P]  26.3 73.54 270 top
U2#16  -  [CONN-SMD_A2008WV-S-8P]  26.3 45.82 270 top
U2#17  -  [CONN-SMD_A2008WV-S-8P]  26.3 18.11 270 top
U2#18  -  [CONN-SMD_A2008WV-S-8P]  56.13 96.22 270 top
U2#19  -  [CONN-SMD_A2008WV-S-8P]  56.13 134.02 270 top
U2#20  -  [CONN-SMD_A2008WV-S-8P]  56.13 68.51 270 top
U2#21  -  [CONN-SMD_A2008WV-S-8P]  56.13 40.8 270 top
U2#22  -  [CONN-SMD_A2008WV-S-8P]  56.13 13.09 270 top
U2#23  -  [CONN-SMD_A2008WV-S-8P]  56.13 217.09 270 top
U2#24  -  [CONN-SMD_A2008WV-S-8P]  56.13 189.38 270 top
U2#25  -  [CONN-SMD_A2008WV-S-8P]  56.13 161.66 270 top
U2#26  -  [CONN-SMD_A2008WV-S-8P]  85.95 217.09 270 top
U2#27  -  [CONN-SMD_A2008WV-S-8P]  85.95 189.38 270 top
U2#28  -  [CONN-SMD_A2008WV-S-8P]  85.95 161.66 270 top
U2#29  -  [CONN-SMD_A2008WV-S-8P]  85.95 133.95 270 top
U2#30  -  [CONN-SMD_A2008WV-S-8P]  85.95 96.22 270 top
U2#31  -  [CONN-SMD_A2008WV-S-8P]  85.95 68.51 270 top
U2#32  -  [CONN-SMD_A2008WV-S-8P]  85.95 40.8 270 top
U3  32.768kHz  [CRYSTAL-SMD_L3.2-W1.5-3]  67.65 14.43 270 top
U3#2  -  [CRYSTAL-SMD_L3.2-W1.5-3]  97.47 213.43 270 top
U3#3  -  [CRYSTAL-SMD_L3.2-W1.5-3]  97.47 185.72 270 top
U3#4  -  [CRYSTAL-SMD_L3.2-W1.5-3]  97.47 158.01 270 top
U3#5  -  [CRYSTAL-SMD_L3.2-W1.5-3]  8 185.73 270 top
U3#6  -  [CRYSTAL-SMD_L3.2-W1.5-3]  97.47 130.3 270 top
U3#7  -  [CRYSTAL-SMD_L3.2-W1.5-3]  97.47 102.59 270 top
U3#8  -  [CRYSTAL-SMD_L3.2-W1.5-3]  97.47 74.88 270 top
U3#9  -  [CRYSTAL-SMD_L3.2-W1.5-3]  97.47 47.16 270 top
U3#10  -  [CRYSTAL-SMD_L3.2-W1.5-3]  97.47 19.45 270 top
U3#11  -  [CRYSTAL-SMD_L3.2-W1.5-3]  8 158.02 270 top
U3#12  -  [CRYSTAL-SMD_L3.2-W1.5-3]  8 213.44 270 top
U3#13  -  [CRYSTAL-SMD_L3.2-W1.5-3]  8 130.3 270 top
U3#14  -  [CRYSTAL-SMD_L3.2-W1.5-3]  8 102.59 270 top
U3#15  -  [CRYSTAL-SMD_L3.2-W1.5-3]  8 74.88 270 top
U3#16  -  [CRYSTAL-SMD_L3.2-W1.5-3]  67.65 42.14 270 top
U3#17  -  [CRYSTAL-SMD_L3.2-W1.5-3]  8 47.17 270 top
U3#18  -  [CRYSTAL-SMD_L3.2-W1.5-3]  8 19.46 270 top
U3#19  -  [CRYSTAL-SMD_L3.2-W1.5-3]  37.82 97.57 270 top
U3#20  -  [CRYSTAL-SMD_L3.2-W1.5-3]  37.82 135.36 270 top
U3#21  -  [CRYSTAL-SMD_L3.2-W1.5-3]  37.82 69.86 270 top
U3#22  -  [CRYSTAL-SMD_L3.2-W1.5-3]  37.82 42.14 270 top
U3#23  -  [CRYSTAL-SMD_L3.2-W1.5-3]  37.82 14.43 270 top
U3#24  -  [CRYSTAL-SMD_L3.2-W1.5-3]  37.82 218.43 270 top
U3#25  -  [CRYSTAL-SMD_L3.2-W1.5-3]  37.82 190.72 270 top
U3#26  -  [CRYSTAL-SMD_L3.2-W1.5-3]  37.82 163.01 270 top
U3#27  -  [CRYSTAL-SMD_L3.2-W1.5-3]  67.65 218.43 270 top
U3#28  -  [CRYSTAL-SMD_L3.2-W1.5-3]  67.65 190.72 270 top
U3#29  -  [CRYSTAL-SMD_L3.2-W1.5-3]  67.65 163.01 270 top
U3#30  -  [CRYSTAL-SMD_L3.2-W1.5-3]  67.65 135.3 270 top
U3#31  -  [CRYSTAL-SMD_L3.2-W1.5-3]  67.65 97.57 270 top
U3#32  -  [CRYSTAL-SMD_L3.2-W1.5-3]  67.65 69.86 270 top
X1  24MHz  [CRYSTAL-SMD_4P-L3.2-W2.5-BL]  6.85 126.14 180 top
X1#2  -  [CRYSTAL-SMD_4P-L3.2-W2.5-BL]  66.5 10.27 180 top
X1#3  -  [CRYSTAL-SMD_4P-L3.2-W2.5-BL]  96.32 209.27 180 top
X1#4  -  [CRYSTAL-SMD_4P-L3.2-W2.5-BL]  96.32 181.56 180 top
X1#5  -  [CRYSTAL-SMD_4P-L3.2-W2.5-BL]  96.32 153.85 180 top
X1#6  -  [CRYSTAL-SMD_4P-L3.2-W2.5-BL]  96.32 126.14 180 top
X1#7  -  [CRYSTAL-SMD_4P-L3.2-W2.5-BL]  96.32 98.43 180 top
X1#8  -  [CRYSTAL-SMD_4P-L3.2-W2.5-BL]  6.85 181.57 180 top
X1#9  -  [CRYSTAL-SMD_4P-L3.2-W2.5-BL]  96.32 70.72 180 top
X1#10  -  [CRYSTAL-SMD_4P-L3.2-W2.5-BL]  96.32 43 180 top
X1#11  -  [CRYSTAL-SMD_4P-L3.2-W2.5-BL]  96.32 15.29 180 top
X1#12  -  [CRYSTAL-SMD_4P-L3.2-W2.5-BL]  6.85 209.28 180 top
X1#13  -  [CRYSTAL-SMD_4P-L3.2-W2.5-BL]  6.85 153.86 180 top
X1#14  -  [CRYSTAL-SMD_4P-L3.2-W2.5-BL]  6.85 98.43 180 top
X1#15  -  [CRYSTAL-SMD_4P-L3.2-W2.5-BL]  6.85 70.72 180 top
X1#16  -  [CRYSTAL-SMD_4P-L3.2-W2.5-BL]  6.85 43.01 180 top
X1#17  -  [CRYSTAL-SMD_4P-L3.2-W2.5-BL]  6.85 15.3 180 top
X1#18  -  [CRYSTAL-SMD_4P-L3.2-W2.5-BL]  36.67 93.41 180 top
X1#19  -  [CRYSTAL-SMD_4P-L3.2-W2.5-BL]  36.67 131.2 180 top
X1#20  -  [CRYSTAL-SMD_4P-L3.2-W2.5-BL]  36.67 65.7 180 top
X1#21  -  [CRYSTAL-SMD_4P-L3.2-W2.5-BL]  36.67 37.98 180 top
X1#22  -  [CRYSTAL-SMD_4P-L3.2-W2.5-BL]  36.67 10.27 180 top
X1#23  -  [CRYSTAL-SMD_4P-L3.2-W2.5-BL]  36.67 214.27 180 top
X1#24  -  [CRYSTAL-SMD_4P-L3.2-W2.5-BL]  36.67 186.56 180 top
X1#25  -  [CRYSTAL-SMD_4P-L3.2-W2.5-BL]  36.67 158.85 180 top
X1#26  -  [CRYSTAL-SMD_4P-L3.2-W2.5-BL]  66.5 214.27 180 top
X1#27  -  [CRYSTAL-SMD_4P-L3.2-W2.5-BL]  66.5 186.56 180 top
X1#28  -  [CRYSTAL-SMD_4P-L3.2-W2.5-BL]  66.5 158.85 180 top
X1#29  -  [CRYSTAL-SMD_4P-L3.2-W2.5-BL]  66.5 131.14 180 top
X1#30  -  [CRYSTAL-SMD_4P-L3.2-W2.5-BL]  66.5 93.41 180 top
X1#31  -  [CRYSTAL-SMD_4P-L3.2-W2.5-BL]  66.5 65.7 180 top
X1#32  -  [CRYSTAL-SMD_4P-L3.2-W2.5-BL]  66.5 37.98 180 top

## Footprints (pads in the part's own frame, mm; a bottom-side part is the same pattern mirrored in y, then rotated)
C0603
  rect 0.8x0.9 smd: 1(-0.7,0) 2(0.7,0)
CONN-SMD_A2008WV-S-8P
  rect 1x2.5 smd: 1(-7,1.724) 2(-5,1.724) 3(-3,1.724) 4(-1,1.724) 5(1,1.724) 6(2.999,1.724) 7(5,1.724) 8(7,1.724)
  rect 1.55x2.6 smd: 9(-9.575,-1.724) 10(9.575,-1.724)
CRYSTAL-SMD_4P-L3.2-W2.5-BL
  rect 1.4x1.2 smd: 1(-1.1,-0.85) 2(1.1,-0.85) 3(1.1,0.85) 4(-1.1,0.85)
CRYSTAL-SMD_L3.2-W1.5-3
  rect 1.35x1.7 smd: 1(-1.075,0) 2(1.075,0)
demo板安装孔
  round 6.32 hole 2.75: 1(0,0)
IDC-TH_10P-P2.54_C5665
  round 1.524 hole 1: 1(-5.08,-1.27) 2(-5.08,1.27) 3(-2.54,-1.27) 4(-2.54,1.27) 5(0,-1.27) 6(0,1.27) 7(2.54,-1.27) 8(2.54,1.27) 9(5.08,-1.27) 10(5.08,1.27)
LQFP-64_L7.0-W7.0-P0.40-LS9.0-TL
  rect 1.46x0.2 smd: 1(-4.13,3) 2(-4.13,2.6) 3(-4.13,2.2) 4(-4.13,1.8) 5(-4.13,1.4) 6(-4.13,1) 7(-4.13,0.6) 8(-4.13,0.2) 9(-4.13,-0.2) 10(-4.13,-0.6) 11(-4.13,-1) 12(-4.13,-1.4) 13(-4.13,-1.8) 14(-4.13,-2.2) 15(-4.13,-2.6) 16(-4.13,-3) 33(4.13,-3) 34(4.13,-2.6) 35(4.13,-2.2) 36(4.13,-1.8) 37(4.13,-1.4) 38(4.13,-1) 39(4.13,-0.6) 40(4.13,-0.2) 41(4.13,0.2) 42(4.13,0.6) 43(4.13,1) 44(4.13,1.4) 45(4.13,1.8) 46(4.13,2.2) 47(4.13,2.6) 48(4.13,3)
  rect 0.2x1.46 smd: 17(-3,-4.13) 18(-2.6,-4.13) 19(-2.2,-4.13) 20(-1.8,-4.13) 21(-1.4,-4.13) 22(-1,-4.13) 23(-0.6,-4.13) 24(-0.2,-4.13) 25(0.2,-4.13) 26(0.6,-4.13) 27(1,-4.13) 28(1.4,-4.13) 29(1.8,-4.13) 30(2.2,-4.13) 31(2.6,-4.13) 32(3,-4.13) 49(3,4.13) 50(2.6,4.13) 51(2.2,4.13) 52(1.8,4.13) 53(1.4,4.13) 54(1,4.13) 55(0.6,4.13) 56(0.2,4.13) 57(-0.2,4.13) 58(-0.6,4.13) 59(-1,4.13) 60(-1.4,4.13) 61(-1.8,4.13) 62(-2.2,4.13) 63(-2.6,4.13) 64(-3,4.13)

## Nets
GND: C1.1 C1#2.1 C1#3.1 C1#4.1 C1#5.1 C1#6.1 C1#7.1 C1#8.1 C1#9.1 C1#10.1 C1#11.1 C1#12.1 C1#13.1 C1#14.1 C1#15.1 C1#16.1 C1#17.1 C1#18.1 C1#19.1 C1#20.1 C1#21.1 C1#22.1 C1#23.1 C1#24.1 C1#25.1 C1#26.1 C1#27.1 C1#28.1 C1#29.1 C1#30.1 C1#31.1 C1#32.1 C2.2 C2#2.2 C2#3.2 C2#4.2 C2#5.2 C2#6.2 C2#7.2 C2#8.2 C2#9.2 C2#10.2 C2#11.2 C2#12.2 C2#13.2 C2#14.2 C2#15.2 C2#16.2 C2#17.2 C2#18.2 C2#19.2 C2#20.2 C2#21.2 C2#22.2 C2#23.2 C2#24.2 C2#25.2 C2#26.2 C2#27.2 C2#28.2 C2#29.2 C2#30.2 C2#31.2 C2#32.2 C3.2 C3#2.2 C3#3.2 C3#4.2 C3#5.2 C3#6.2 C3#7.2 C3#8.2 C3#9.2 C3#10.2 C3#11.2 C3#12.2 C3#13.2 C3#14.2 C3#15.2 C3#16.2 C3#17.2 C3#18.2 C3#19.2 C3#20.2 C3#21.2 C3#22.2 C3#23.2 C3#24.2 C3#25.2 C3#26.2 C3#27.2 C3#28.2 C3#29.2 C3#30.2 C3#31.2 C3#32.2 C4.2 C4#2.2 C4#3.2 C4#4.2 C4#5.2 C4#6.2 C4#7.2 C4#8.2 C4#9.2 C4#10.2 C4#11.2 C4#12.2 C4#13.2 C4#14.2 C4#15.2 C4#16.2 C4#17.2 C4#18.2 C4#19.2 C4#20.2 C4#21.2 C4#22.2 C4#23.2 C4#24.2 C4#25.2 C4#26.2 C4#27.2 C4#28.2 C4#29.2 C4#30.2 C4#31.2 C4#32.2 C5.2 C5#2.2 C5#3.2 C5#4.2 C5#5.2 C5#6.2 C5#7.2 C5#8.2 C5#9.2 C5#10.2 C5#11.2 C5#12.2 C5#13.2 C5#14.2 C5#15.2 C5#16.2 C5#17.2 C5#18.2 C5#19.2 C5#20.2 C5#21.2 C5#22.2 C5#23.2 C5#24.2 C5#25.2 C5#26.2 C5#27.2 C5#28.2 C5#29.2 C5#30.2 C5#31.2 C5#32.2 C6.1 C6#2.1 C6#3.1 C6#4.1 C6#5.1 C6#6.1 C6#7.1 C6#8.1 C6#9.1 C6#10.1 C6#11.1 C6#12.1 C6#13.1 C6#14.1 C6#15.1 C6#16.1 C6#17.1 C6#18.1 C6#19.1 C6#20.1 C6#21.1 C6#22.1 C6#23.1 C6#24.1 C6#25.1 C6#26.1 C6#27.1 C6#28.1 C6#29.1 C6#30.1 C6#31.1 C6#32.1 C7.2 C7#2.2 C7#3.2 C7#4.2 C7#5.2 C7#6.2 C7#7.2 C7#8.2 C7#9.2 C7#10.2 C7#11.2 C7#12.2 C7#13.2 C7#14.2 C7#15.2 C7#16.2 C7#17.2 C7#18.2 C7#19.2 C7#20.2 C7#21.2 C7#22.2 C7#23.2 C7#24.2 C7#25.2 C7#26.2 C7#27.2 C7#28.2 C7#29.2 C7#30.2 C7#31.2 C7#32.2 C8.1 C8#2.1 C8#3.1 C8#4.1 C8#5.1 C8#6.1 C8#7.1 C8#8.1 C8#9.1 C8#10.1 C8#11.1 C8#12.1 C8#13.1 C8#14.1 C8#15.1 C8#16.1 C8#17.1 C8#18.1 C8#19.1 C8#20.1 C8#21.1 C8#22.1 C8#23.1 C8#24.1 C8#25.1 C8#26.1 C8#27.1 C8#28.1 C8#29.1 C8#30.1 C8#31.1 C8#32.1 C9.2 C9#2.2 C9#3.2 C9#4.2 C9#5.2 C9#6.2 C9#7.2 C9#8.2 C9#9.2 C9#10.2 C9#11.2 C9#12.2 C9#13.2 C9#14.2 C9#15.2 C9#16.2 C9#17.2 C9#18.2 C9#19.2 C9#20.2 C9#21.2 C9#22.2 C9#23.2 C9#24.2 C9#25.2 C9#26.2 C9#27.2 C9#28.2 C9#29.2 C9#30.2 C9#31.2 C9#32.2 C10.1 C10#2.1 C10#3.1 C10#4.1 C10#5.1 C10#6.1 C10#7.1 C10#8.1 C10#9.1 C10#10.1 C10#11.1 C10#12.1 C10#13.1 C10#14.1 C10#15.1 C10#16.1 C10#17.1 C10#18.1 C10#19.1 C10#20.1 C10#21.1 C10#22.1 C10#23.1 C10#24.1 C10#25.1 C10#26.1 C10#27.1 C10#28.1 C10#29.1 C10#30.1 C10#31.1 C10#32.1 C11.2 C11#2.2 C11#3.2 C11#4.2 C11#5.2 C11#6.2 C11#7.2 C11#8.2 C11#9.2 C11#10.2 C11#11.2 C11#12.2 C11#13.2 C11#14.2 C11#15.2 C11#16.2 C11#17.2 C11#18.2 C11#19.2 C11#20.2 C11#21.2 C11#22.2 C11#23.2 C11#24.2 C11#25.2 C11#26.2 C11#27.2 C11#28.2 C11#29.2 C11#30.2 C11#31.2 C11#32.2 C12.1 C12#2.1 C12#3.1 C12#4.1 C12#5.1 C12#6.1 C12#7.1 C12#8.1 C12#9.1 C12#10.1 C12#11.1 C12#12.1 C12#13.1 C12#14.1 C12#15.1 C12#16.1 C12#17.1 C12#18.1 C12#19.1 C12#20.1 C12#21.1 C12#22.1 C12#23.1 C12#24.1 C12#25.1 C12#26.1 C12#27.1 C12#28.1 C12#29.1 C12#30.1 C12#31.1 C12#32.1 J1.1 J2.1 J3.1 J4.1 J5.1 J6.1 P1.9 P1#2.9 P1#3.9 P1#4.9 P1#5.9 P1#6.9 P1#7.9 P1#8.9 P1#9.9 P1#10.9 P1#11.9 P1#12.9 P1#13.9 P1#14.9 P1#15.9 P1#16.9 P1#17.9 P1#18.9 P1#19.9 P1#20.9 P1#21.9 P1#22.9 P1#23.9 P1#24.9 P1#25.9 P1#26.9 P1#27.9 P1#28.9 P1#29.9 P1#30.9 P1#31.9 P1#32.9 U1.12 U1.31 U1.63 U1#2.12 U1#2.31 U1#2.63 U1#3.12 U1#3.31 U1#3.63 U1#4.12 U1#4.31 U1#4.63 U1#5.12 U1#5.31 U1#5.63 U1#6.12 U1#6.31 U1#6.63 U1#7.12 U1#7.31 U1#7.63 U1#8.12 U1#8.31 U1#8.63 U1#9.12 U1#9.31 U1#9.63 U1#10.12 U1#10.31 U1#10.63 U1#11.12 U1#11.31 U1#11.63 U1#12.12 U1#12.31 U1#12.63 U1#13.12 U1#13.31 U1#13.63 U1#14.12 U1#14.31 U1#14.63 U1#15.12 U1#15.31 U1#15.63 U1#16.12 U1#16.31 U1#16.63 U1#17.12 U1#17.31 U1#17.63 U1#18.12 U1#18.31 U1#18.63 U1#19.12 U1#19.31 U1#19.63 U1#20.12 U1#20.31 U1#20.63 U1#21.12 U1#21.31 U1#21.63 U1#22.12 U1#22.31 U1#22.63 U1#23.12 U1#23.31 U1#23.63 U1#24.12 U1#24.31 U1#24.63 U1#25.12 U1#25.31 U1#25.63 U1#26.12 U1#26.31 U1#26.63 U1#27.12 U1#27.31 U1#27.63 U1#28.12 U1#28.31 U1#28.63 U1#29.12 U1#29.31 U1#29.63 U1#30.12 U1#30.31 U1#30.63 U1#31.12 U1#31.31 U1#31.63 U1#32.12 U1#32.31 U1#32.63 U2.8 U2.9 U2.10 U2#2.8 U2#2.9 U2#2.10 U2#3.8 U2#3.9 U2#3.10 U2#4.8 U2#4.9 U2#4.10 U2#5.8 U2#5.9 U2#5.10 U2#6.8 U2#6.9 U2#6.10 U2#7.8 U2#7.9 U2#7.10 U2#8.8 U2#8.9 U2#8.10 U2#9.8 U2#9.9 U2#9.10 U2#10.8 U2#10.9 U2#10.10 U2#11.8 U2#11.9 U2#11.10 U2#12.8 U2#12.9 U2#12.10 U2#13.8 U2#13.9 U2#13.10 U2#14.8 U2#14.9 U2#14.10 U2#15.8 U2#15.9 U2#15.10 U2#16.8 U2#16.9 U2#16.10 U2#17.8 U2#17.9 U2#17.10 U2#18.8 U2#18.9 U2#18.10 U2#19.8 U2#19.9 U2#19.10 U2#20.8 U2#20.9 U2#20.10 U2#21.8 U2#21.9 U2#21.10 U2#22.8 U2#22.9 U2#22.10 U2#23.8 U2#23.9 U2#23.10 U2#24.8 U2#24.9 U2#24.10 U2#25.8 U2#25.9 U2#25.10 U2#26.8 U2#26.9 U2#26.10 U2#27.8 U2#27.9 U2#27.10 U2#28.8 U2#28.9 U2#28.10 U2#29.8 U2#29.9 U2#29.10 U2#30.8 U2#30.9 U2#30.10 U2#31.8 U2#31.9 U2#31.10 U2#32.8 U2#32.9 U2#32.10 X1.2 X1.4 X1#2.2 X1#2.4 X1#3.2 X1#3.4 X1#4.2 X1#4.4 X1#5.2 X1#5.4 X1#6.2 X1#6.4 X1#7.2 X1#7.4 X1#8.2 X1#8.4 X1#9.2 X1#9.4 X1#10.2 X1#10.4 X1#11.2 X1#11.4 X1#12.2 X1#12.4 X1#13.2 X1#13.4 X1#14.2 X1#14.4 X1#15.2 X1#15.4 X1#16.2 X1#16.4 X1#17.2 X1#17.4 X1#18.2 X1#18.4 X1#19.2 X1#19.4 X1#20.2 X1#20.4 X1#21.2 X1#21.4 X1#22.2 X1#22.4 X1#23.2 X1#23.4 X1#24.2 X1#24.4 X1#25.2 X1#25.4 X1#26.2 X1#26.4 X1#27.2 X1#27.4 X1#28.2 X1#28.4 X1#29.2 X1#29.4 X1#30.2 X1#30.4 X1#31.2 X1#31.4 X1#32.2 X1#32.4
VDD: C5.1 C5#2.1 C5#3.1 C5#4.1 C5#5.1 C5#6.1 C5#7.1 C5#8.1 C5#9.1 C5#10.1 C5#11.1 C5#12.1 C5#13.1 C5#14.1 C5#15.1 C5#16.1 C5#17.1 C5#18.1 C5#19.1 C5#20.1 C5#21.1 C5#22.1 C5#23.1 C5#24.1 C5#25.1 C5#26.1 C5#27.1 C5#28.1 C5#29.1 C5#30.1 C5#31.1 C5#32.1 C6.2 C6#2.2 C6#3.2 C6#4.2 C6#5.2 C6#6.2 C6#7.2 C6#8.2 C6#9.2 C6#10.2 C6#11.2 C6#12.2 C6#13.2 C6#14.2 C6#15.2 C6#16.2 C6#17.2 C6#18.2 C6#19.2 C6#20.2 C6#21.2 C6#22.2 C6#23.2 C6#24.2 C6#25.2 C6#26.2 C6#27.2 C6#28.2 C6#29.2 C6#30.2 C6#31.2 C6#32.2 C7.1 C7#2.1 C7#3.1 C7#4.1 C7#5.1 C7#6.1 C7#7.1 C7#8.1 C7#9.1 C7#10.1 C7#11.1 C7#12.1 C7#13.1 C7#14.1 C7#15.1 C7#16.1 C7#17.1 C7#18.1 C7#19.1 C7#20.1 C7#21.1 C7#22.1 C7#23.1 C7#24.1 C7#25.1 C7#26.1 C7#27.1 C7#28.1 C7#29.1 C7#30.1 C7#31.1 C7#32.1 C8.2 C8#2.2 C8#3.2 C8#4.2 C8#5.2 C8#6.2 C8#7.2 C8#8.2 C8#9.2 C8#10.2 C8#11.2 C8#12.2 C8#13.2 C8#14.2 C8#15.2 C8#16.2 C8#17.2 C8#18.2 C8#19.2 C8#20.2 C8#21.2 C8#22.2 C8#23.2 C8#24.2 C8#25.2 C8#26.2 C8#27.2 C8#28.2 C8#29.2 C8#30.2 C8#31.2 C8#32.2 C9.1 C9#2.1 C9#3.1 C9#4.1 C9#5.1 C9#6.1 C9#7.1 C9#8.1 C9#9.1 C9#10.1 C9#11.1 C9#12.1 C9#13.1 C9#14.1 C9#15.1 C9#16.1 C9#17.1 C9#18.1 C9#19.1 C9#20.1 C9#21.1 C9#22.1 C9#23.1 C9#24.1 C9#25.1 C9#26.1 C9#27.1 C9#28.1 C9#29.1 C9#30.1 C9#31.1 C9#32.1 C10.2 C10#2.2 C10#3.2 C10#4.2 C10#5.2 C10#6.2 C10#7.2 C10#8.2 C10#9.2 C10#10.2 C10#11.2 C10#12.2 C10#13.2 C10#14.2 C10#15.2 C10#16.2 C10#17.2 C10#18.2 C10#19.2 C10#20.2 C10#21.2 C10#22.2 C10#23.2 C10#24.2 C10#25.2 C10#26.2 C10#27.2 C10#28.2 C10#29.2 C10#30.2 C10#31.2 C10#32.2 C11.1 C11#2.1 C11#3.1 C11#4.1 C11#5.1 C11#6.1 C11#7.1 C11#8.1 C11#9.1 C11#10.1 C11#11.1 C11#12.1 C11#13.1 C11#14.1 C11#15.1 C11#16.1 C11#17.1 C11#18.1 C11#19.1 C11#20.1 C11#21.1 C11#22.1 C11#23.1 C11#24.1 C11#25.1 C11#26.1 C11#27.1 C11#28.1 C11#29.1 C11#30.1 C11#31.1 C11#32.1 C12.2 C12#2.2 C12#3.2 C12#4.2 C12#5.2 C12#6.2 C12#7.2 C12#8.2 C12#9.2 C12#10.2 C12#11.2 C12#12.2 C12#13.2 C12#14.2 C12#15.2 C12#16.2 C12#17.2 C12#18.2 C12#19.2 C12#20.2 C12#21.2 C12#22.2 C12#23.2 C12#24.2 C12#25.2 C12#26.2 C12#27.2 C12#28.2 C12#29.2 C12#30.2 C12#31.2 C12#32.2 P1.4 P1#2.4 P1#3.4 P1#4.4 P1#5.4 P1#6.4 P1#7.4 P1#8.4 P1#9.4 P1#10.4 P1#11.4 P1#12.4 P1#13.4 P1#14.4 P1#15.4 P1#16.4 P1#17.4 P1#18.4 P1#19.4 P1#20.4 P1#21.4 P1#22.4 P1#23.4 P1#24.4 P1#25.4 P1#26.4 P1#27.4 P1#28.4 P1#29.4 P1#30.4 P1#31.4 P1#32.4 U1.1 U1.13 U1.32 U1.64 U1#2.1 U1#2.13 U1#2.32 U1#2.64 U1#3.1 U1#3.13 U1#3.32 U1#3.64 U1#4.1 U1#4.13 U1#4.32 U1#4.64 U1#5.1 U1#5.13 U1#5.32 U1#5.64 U1#6.1 U1#6.13 U1#6.32 U1#6.64 U1#7.1 U1#7.13 U1#7.32 U1#7.64 U1#8.1 U1#8.13 U1#8.32 U1#8.64 U1#9.1 U1#9.13 U1#9.32 U1#9.64 U1#10.1 U1#10.13 U1#10.32 U1#10.64 U1#11.1 U1#11.13 U1#11.32 U1#11.64 U1#12.1 U1#12.13 U1#12.32 U1#12.64 U1#13.1 U1#13.13 U1#13.32 U1#13.64 U1#14.1 U1#14.13 U1#14.32 U1#14.64 U1#15.1 U1#15.13 U1#15.32 U1#15.64 U1#16.1 U1#16.13 U1#16.32 U1#16.64 U1#17.1 U1#17.13 U1#17.32 U1#17.64 U1#18.1 U1#18.13 U1#18.32 U1#18.64 U1#19.1 U1#19.13 U1#19.32 U1#19.64 U1#20.1 U1#20.13 U1#20.32 U1#20.64 U1#21.1 U1#21.13 U1#21.32 U1#21.64 U1#22.1 U1#22.13 U1#22.32 U1#22.64 U1#23.1 U1#23.13 U1#23.32 U1#23.64 U1#24.1 U1#24.13 U1#24.32 U1#24.64 U1#25.1 U1#25.13 U1#25.32 U1#25.64 U1#26.1 U1#26.13 U1#26.32 U1#26.64 U1#27.1 U1#27.13 U1#27.32 U1#27.64 U1#28.1 U1#28.13 U1#28.32 U1#28.64 U1#29.1 U1#29.13 U1#29.32 U1#29.64 U1#30.1 U1#30.13 U1#30.32 U1#30.64 U1#31.1 U1#31.13 U1#31.32 U1#31.64 U1#32.1 U1#32.13 U1#32.32 U1#32.64 U2.1 U2#2.1 U2#3.1 U2#4.1 U2#5.1 U2#6.1 U2#7.1 U2#8.1 U2#9.1 U2#10.1 U2#11.1 U2#12.1 U2#13.1 U2#14.1 U2#15.1 U2#16.1 U2#17.1 U2#18.1 U2#19.1 U2#20.1 U2#21.1 U2#22.1 U2#23.1 U2#24.1 U2#25.1 U2#26.1 U2#27.1 U2#28.1 U2#29.1 U2#30.1 U2#31.1 U2#32.1
MCO: P1.6 P1#2.6 P1#3.6 P1#4.6 P1#5.6 P1#6.6 P1#7.6 P1#8.6 P1#9.6 P1#10.6 P1#11.6 P1#12.6 P1#13.6 P1#14.6 P1#15.6 P1#16.6 P1#17.6 P1#18.6 P1#19.6 P1#20.6 P1#21.6 P1#22.6 P1#23.6 P1#24.6 P1#25.6 P1#26.6 P1#27.6 P1#28.6 P1#29.6 P1#30.6 P1#31.6 P1#32.6 U1.2 U1.60 U1#2.2 U1#2.60 U1#3.2 U1#3.60 U1#4.2 U1#4.60 U1#5.2 U1#5.60 U1#6.2 U1#6.60 U1#7.2 U1#7.60 U1#8.2 U1#8.60 U1#9.2 U1#9.60 U1#10.2 U1#10.60 U1#11.2 U1#11.60 U1#12.2 U1#12.60 U1#13.2 U1#13.60 U1#14.2 U1#14.60 U1#15.2 U1#15.60 U1#16.2 U1#16.60 U1#17.2 U1#17.60 U1#18.2 U1#18.60 U1#19.2 U1#19.60 U1#20.2 U1#20.60 U1#21.2 U1#21.60 U1#22.2 U1#22.60 U1#23.2 U1#23.60 U1#24.2 U1#24.60 U1#25.2 U1#25.60 U1#26.2 U1#26.60 U1#27.2 U1#27.60 U1#28.2 U1#28.60 U1#29.2 U1#29.60 U1#30.2 U1#30.60 U1#31.2 U1#31.60 U1#32.2 U1#32.60 U2.7 U2#2.7 U2#3.7 U2#4.7 U2#5.7 U2#6.7 U2#7.7 U2#8.7 U2#9.7 U2#10.7 U2#11.7 U2#12.7 U2#13.7 U2#14.7 U2#15.7 U2#16.7 U2#17.7 U2#18.7 U2#19.7 U2#20.7 U2#21.7 U2#22.7 U2#23.7 U2#24.7 U2#25.7 U2#26.7 U2#27.7 U2#28.7 U2#29.7 U2#30.7 U2#31.7 U2#32.7
OSC32_IN: C4.1 C4#2.1 C4#3.1 C4#4.1 C4#5.1 C4#6.1 C4#7.1 C4#8.1 C4#9.1 C4#10.1 C4#11.1 C4#12.1 C4#13.1 C4#14.1 C4#15.1 C4#16.1 C4#17.1 C4#18.1 C4#19.1 C4#20.1 C4#21.1 C4#22.1 C4#23.1 C4#24.1 C4#25.1 C4#26.1 C4#27.1 C4#28.1 C4#29.1 C4#30.1 C4#31.1 C4#32.1 U1.3 U1#2.3 U1#3.3 U1#4.3 U1#5.3 U1#6.3 U1#7.3 U1#8.3 U1#9.3 U1#10.3 U1#11.3 U1#12.3 U1#13.3 U1#14.3 U1#15.3 U1#16.3 U1#17.3 U1#18.3 U1#19.3 U1#20.3 U1#21.3 U1#22.3 U1#23.3 U1#24.3 U1#25.3 U1#26.3 U1#27.3 U1#28.3 U1#29.3 U1#30.3 U1#31.3 U1#32.3 U3.1 U3#2.1 U3#3.1 U3#4.1 U3#5.1 U3#6.1 U3#7.1 U3#8.1 U3#9.1 U3#10.1 U3#11.1 U3#12.1 U3#13.1 U3#14.1 U3#15.1 U3#16.1 U3#17.1 U3#18.1 U3#19.1 U3#20.1 U3#21.1 U3#22.1 U3#23.1 U3#24.1 U3#25.1 U3#26.1 U3#27.1 U3#28.1 U3#29.1 U3#30.1 U3#31.1 U3#32.1
OSC32_OUT: C3.1 C3#2.1 C3#3.1 C3#4.1 C3#5.1 C3#6.1 C3#7.1 C3#8.1 C3#9.1 C3#10.1 C3#11.1 C3#12.1 C3#13.1 C3#14.1 C3#15.1 C3#16.1 C3#17.1 C3#18.1 C3#19.1 C3#20.1 C3#21.1 C3#22.1 C3#23.1 C3#24.1 C3#25.1 C3#26.1 C3#27.1 C3#28.1 C3#29.1 C3#30.1 C3#31.1 C3#32.1 U1.4 U1#2.4 U1#3.4 U1#4.4 U1#5.4 U1#6.4 U1#7.4 U1#8.4 U1#9.4 U1#10.4 U1#11.4 U1#12.4 U1#13.4 U1#14.4 U1#15.4 U1#16.4 U1#17.4 U1#18.4 U1#19.4 U1#20.4 U1#21.4 U1#22.4 U1#23.4 U1#24.4 U1#25.4 U1#26.4 U1#27.4 U1#28.4 U1#29.4 U1#30.4 U1#31.4 U1#32.4 U3.2 U3#2.2 U3#3.2 U3#4.2 U3#5.2 U3#6.2 U3#7.2 U3#8.2 U3#9.2 U3#10.2 U3#11.2 U3#12.2 U3#13.2 U3#14.2 U3#15.2 U3#16.2 U3#17.2 U3#18.2 U3#19.2 U3#20.2 U3#21.2 U3#22.2 U3#23.2 U3#24.2 U3#25.2 U3#26.2 U3#27.2 U3#28.2 U3#29.2 U3#30.2 U3#31.2 U3#32.2
OSC_IN: C2.1 C2#2.1 C2#3.1 C2#4.1 C2#5.1 C2#6.1 C2#7.1 C2#8.1 C2#9.1 C2#10.1 C2#11.1 C2#12.1 C2#13.1 C2#14.1 C2#15.1 C2#16.1 C2#17.1 C2#18.1 C2#19.1 C2#20.1 C2#21.1 C2#22.1 C2#23.1 C2#24.1 C2#25.1 C2#26.1 C2#27.1 C2#28.1 C2#29.1 C2#30.1 C2#31.1 C2#32.1 U1.5 U1#2.5 U1#3.5 U1#4.5 U1#5.5 U1#6.5 U1#7.5 U1#8.5 U1#9.5 U1#10.5 U1#11.5 U1#12.5 U1#13.5 U1#14.5 U1#15.5 U1#16.5 U1#17.5 U1#18.5 U1#19.5 U1#20.5 U1#21.5 U1#22.5 U1#23.5 U1#24.5 U1#25.5 U1#26.5 U1#27.5 U1#28.5 U1#29.5 U1#30.5 U1#31.5 U1#32.5 X1.1 X1#2.1 X1#3.1 X1#4.1 X1#5.1 X1#6.1 X1#7.1 X1#8.1 X1#9.1 X1#10.1 X1#11.1 X1#12.1 X1#13.1 X1#14.1 X1#15.1 X1#16.1 X1#17.1 X1#18.1 X1#19.1 X1#20.1 X1#21.1 X1#22.1 X1#23.1 X1#24.1 X1#25.1 X1#26.1 X1#27.1 X1#28.1 X1#29.1 X1#30.1 X1#31.1 X1#32.1
OSC_OUT: C1.2 C1#2.2 C1#3.2 C1#4.2 C1#5.2 C1#6.2 C1#7.2 C1#8.2 C1#9.2 C1#10.2 C1#11.2 C1#12.2 C1#13.2 C1#14.2 C1#15.2 C1#16.2 C1#17.2 C1#18.2 C1#19.2 C1#20.2 C1#21.2 C1#22.2 C1#23.2 C1#24.2 C1#25.2 C1#26.2 C1#27.2 C1#28.2 C1#29.2 C1#30.2 C1#31.2 C1#32.2 U1.6 U1#2.6 U1#3.6 U1#4.6 U1#5.6 U1#6.6 U1#7.6 U1#8.6 U1#9.6 U1#10.6 U1#11.6 U1#12.6 U1#13.6 U1#14.6 U1#15.6 U1#16.6 U1#17.6 U1#18.6 U1#19.6 U1#20.6 U1#21.6 U1#22.6 U1#23.6 U1#24.6 U1#25.6 U1#26.6 U1#27.6 U1#28.6 U1#29.6 U1#30.6 U1#31.6 U1#32.6 X1.3 X1#2.3 X1#3.3 X1#4.3 X1#5.3 X1#6.3 X1#7.3 X1#8.3 X1#9.3 X1#10.3 X1#11.3 X1#12.3 X1#13.3 X1#14.3 X1#15.3 X1#16.3 X1#17.3 X1#18.3 X1#19.3 X1#20.3 X1#21.3 X1#22.3 X1#23.3 X1#24.3 X1#25.3 X1#26.3 X1#27.3 X1#28.3 X1#29.3 X1#30.3 X1#31.3 X1#32.3
RSTN: P1.2 P1#2.2 P1#3.2 P1#4.2 P1#5.2 P1#6.2 P1#7.2 P1#8.2 P1#9.2 P1#10.2 P1#11.2 P1#12.2 P1#13.2 P1#14.2 P1#15.2 P1#16.2 P1#17.2 P1#18.2 P1#19.2 P1#20.2 P1#21.2 P1#22.2 P1#23.2 P1#24.2 P1#25.2 P1#26.2 P1#27.2 P1#28.2 P1#29.2 P1#30.2 P1#31.2 P1#32.2 U1.7 U1#2.7 U1#3.7 U1#4.7 U1#5.7 U1#6.7 U1#7.7 U1#8.7 U1#9.7 U1#10.7 U1#11.7 U1#12.7 U1#13.7 U1#14.7 U1#15.7 U1#16.7 U1#17.7 U1#18.7 U1#19.7 U1#20.7 U1#21.7 U1#22.7 U1#23.7 U1#24.7 U1#25.7 U1#26.7 U1#27.7 U1#28.7 U1#29.7 U1#30.7 U1#31.7 U1#32.7 U2.6 U2#2.6 U2#3.6 U2#4.6 U2#5.6 U2#6.6 U2#7.6 U2#8.6 U2#9.6 U2#10.6 U2#11.6 U2#12.6 U2#13.6 U2#14.6 U2#15.6 U2#16.6 U2#17.6 U2#18.6 U2#19.6 U2#20.6 U2#21.6 U2#22.6 U2#23.6 U2#24.6 U2#25.6 U2#26.6 U2#27.6 U2#28.6 U2#29.6 U2#30.6 U2#31.6 U2#32.6
SWCLK: U1.49 U1#2.49 U1#3.49 U1#4.49 U1#5.49 U1#6.49 U1#7.49 U1#8.49 U1#9.49 U1#10.49 U1#11.49 U1#12.49 U1#13.49 U1#14.49 U1#15.49 U1#16.49 U1#17.49 U1#18.49 U1#19.49 U1#20.49 U1#21.49 U1#22.49 U1#23.49 U1#24.49 U1#25.49 U1#26.49 U1#27.49 U1#28.49 U1#29.49 U1#30.49 U1#31.49 U1#32.49 U2.3 U2#2.3 U2#3.3 U2#4.3 U2#5.3 U2#6.3 U2#7.3 U2#8.3 U2#9.3 U2#10.3 U2#11.3 U2#12.3 U2#13.3 U2#14.3 U2#15.3 U2#16.3 U2#17.3 U2#18.3 U2#19.3 U2#20.3 U2#21.3 U2#22.3 U2#23.3 U2#24.3 U2#25.3 U2#26.3 U2#27.3 U2#28.3 U2#29.3 U2#30.3 U2#31.3 U2#32.3
TAI: P1.10 P1#2.10 P1#3.10 P1#4.10 P1#5.10 P1#6.10 P1#7.10 P1#8.10 P1#9.10 P1#10.10 P1#11.10 P1#12.10 P1#13.10 P1#14.10 P1#15.10 P1#16.10 P1#17.10 P1#18.10 P1#19.10 P1#20.10 P1#21.10 P1#22.10 P1#23.10 P1#24.10 P1#25.10 P1#26.10 P1#27.10 P1#28.10 P1#29.10 P1#30.10 P1#31.10 P1#32.10 U1.45 U1#2.45 U1#3.45 U1#4.45 U1#5.45 U1#6.45 U1#7.45 U1#8.45 U1#9.45 U1#10.45 U1#11.45 U1#12.45 U1#13.45 U1#14.45 U1#15.45 U1#16.45 U1#17.45 U1#18.45 U1#19.45 U1#20.45 U1#21.45 U1#22.45 U1#23.45 U1#24.45 U1#25.45 U1#26.45 U1#27.45 U1#28.45 U1#29.45 U1#30.45 U1#31.45 U1#32.45
TAO/SWDIO: P1.8 P1#2.8 P1#3.8 P1#4.8 P1#5.8 P1#6.8 P1#7.8 P1#8.8 P1#9.8 P1#10.8 P1#11.8 P1#12.8 P1#13.8 P1#14.8 P1#15.8 P1#16.8 P1#17.8 P1#18.8 P1#19.8 P1#20.8 P1#21.8 P1#22.8 P1#23.8 P1#24.8 P1#25.8 P1#26.8 P1#27.8 P1#28.8 P1#29.8 P1#30.8 P1#31.8 P1#32.8 U1.46 U1#2.46 U1#3.46 U1#4.46 U1#5.46 U1#6.46 U1#7.46 U1#8.46 U1#9.46 U1#10.46 U1#11.46 U1#12.46 U1#13.46 U1#14.46 U1#15.46 U1#16.46 U1#17.46 U1#18.46 U1#19.46 U1#20.46 U1#21.46 U1#22.46 U1#23.46 U1#24.46 U1#25.46 U1#26.46 U1#27.46 U1#28.46 U1#29.46 U1#30.46 U1#31.46 U1#32.46 U2.2 U2#2.2 U2#3.2 U2#4.2 U2#5.2 U2#6.2 U2#7.2 U2#8.2 U2#9.2 U2#10.2 U2#11.2 U2#12.2 U2#13.2 U2#14.2 U2#15.2 U2#16.2 U2#17.2 U2#18.2 U2#19.2 U2#20.2 U2#21.2 U2#22.2 U2#23.2 U2#24.2 U2#25.2 U2#26.2 U2#27.2 U2#28.2 U2#29.2 U2#30.2 U2#31.2 U2#32.2
TCK: P1.5 P1#2.5 P1#3.5 P1#4.5 P1#5.5 P1#6.5 P1#7.5 P1#8.5 P1#9.5 P1#10.5 P1#11.5 P1#12.5 P1#13.5 P1#14.5 P1#15.5 P1#16.5 P1#17.5 P1#18.5 P1#19.5 P1#20.5 P1#21.5 P1#22.5 P1#23.5 P1#24.5 P1#25.5 P1#26.5 P1#27.5 P1#28.5 P1#29.5 P1#30.5 P1#31.5 P1#32.5 U1.41 U1#2.41 U1#3.41 U1#4.41 U1#5.41 U1#6.41 U1#7.41 U1#8.41 U1#9.41 U1#10.41 U1#11.41 U1#12.41 U1#13.41 U1#14.41 U1#15.41 U1#16.41 U1#17.41 U1#18.41 U1#19.41 U1#20.41 U1#21.41 U1#22.41 U1#23.41 U1#24.41 U1#25.41 U1#26.41 U1#27.41 U1#28.41 U1#29.41 U1#30.41 U1#31.41 U1#32.41
TDI: P1.3 P1#2.3 P1#3.3 P1#4.3 P1#5.3 P1#6.3 P1#7.3 P1#8.3 P1#9.3 P1#10.3 P1#11.3 P1#12.3 P1#13.3 P1#14.3 P1#15.3 P1#16.3 P1#17.3 P1#18.3 P1#19.3 P1#20.3 P1#21.3 P1#22.3 P1#23.3 P1#24.3 P1#25.3 P1#26.3 P1#27.3 P1#28.3 P1#29.3 P1#30.3 P1#31.3 P1#32.3 U1.43 U1#2.43 U1#3.43 U1#4.43 U1#5.43 U1#6.43 U1#7.43 U1#8.43 U1#9.43 U1#10.43 U1#11.43 U1#12.43 U1#13.43 U1#14.43 U1#15.43 U1#16.43 U1#17.43 U1#18.43 U1#19.43 U1#20.43 U1#21.43 U1#22.43 U1#23.43 U1#24.43 U1#25.43 U1#26.43 U1#27.43 U1#28.43 U1#29.43 U1#30.43 U1#31.43 U1#32.43
TDO: P1.1 P1#2.1 P1#3.1 P1#4.1 P1#5.1 P1#6.1 P1#7.1 P1#8.1 P1#9.1 P1#10.1 P1#11.1 P1#12.1 P1#13.1 P1#14.1 P1#15.1 P1#16.1 P1#17.1 P1#18.1 P1#19.1 P1#20.1 P1#21.1 P1#22.1 P1#23.1 P1#24.1 P1#25.1 P1#26.1 P1#27.1 P1#28.1 P1#29.1 P1#30.1 P1#31.1 P1#32.1 U1.44 U1#2.44 U1#3.44 U1#4.44 U1#5.44 U1#6.44 U1#7.44 U1#8.44 U1#9.44 U1#10.44 U1#11.44 U1#12.44 U1#13.44 U1#14.44 U1#15.44 U1#16.44 U1#17.44 U1#18.44 U1#19.44 U1#20.44 U1#21.44 U1#22.44 U1#23.44 U1#24.44 U1#25.44 U1#26.44 U1#27.44 U1#28.44 U1#29.44 U1#30.44 U1#31.44 U1#32.44
TSTROBE: P1.7 P1#2.7 P1#3.7 P1#4.7 P1#5.7 P1#6.7 P1#7.7 P1#8.7 P1#9.7 P1#10.7 P1#11.7 P1#12.7 P1#13.7 P1#14.7 P1#15.7 P1#16.7 P1#17.7 P1#18.7 P1#19.7 P1#20.7 P1#21.7 P1#22.7 P1#23.7 P1#24.7 P1#25.7 P1#26.7 P1#27.7 P1#28.7 P1#29.7 P1#30.7 P1#31.7 P1#32.7 U1.42 U1#2.42 U1#3.42 U1#4.42 U1#5.42 U1#6.42 U1#7.42 U1#8.42 U1#9.42 U1#10.42 U1#11.42 U1#12.42 U1#13.42 U1#14.42 U1#15.42 U1#16.42 U1#17.42 U1#18.42 U1#19.42 U1#20.42 U1#21.42 U1#22.42 U1#23.42 U1#24.42 U1#25.42 U1#26.42 U1#27.42 U1#28.42 U1#29.42 U1#30.42 U1#31.42 U1#32.42
UART_RX: U1.19 U1#2.19 U1#3.19 U1#4.19 U1#5.19 U1#6.19 U1#7.19 U1#8.19 U1#9.19 U1#10.19 U1#11.19 U1#12.19 U1#13.19 U1#14.19 U1#15.19 U1#16.19 U1#17.19 U1#18.19 U1#19.19 U1#20.19 U1#21.19 U1#22.19 U1#23.19 U1#24.19 U1#25.19 U1#26.19 U1#27.19 U1#28.19 U1#29.19 U1#30.19 U1#31.19 U1#32.19 U2.5 U2#2.5 U2#3.5 U2#4.5 U2#5.5 U2#6.5 U2#7.5 U2#8.5 U2#9.5 U2#10.5 U2#11.5 U2#12.5 U2#13.5 U2#14.5 U2#15.5 U2#16.5 U2#17.5 U2#18.5 U2#19.5 U2#20.5 U2#21.5 U2#22.5 U2#23.5 U2#24.5 U2#25.5 U2#26.5 U2#27.5 U2#28.5 U2#29.5 U2#30.5 U2#31.5 U2#32.5
UART_TX: U1.18 U1#2.18 U1#3.18 U1#4.18 U1#5.18 U1#6.18 U1#7.18 U1#8.18 U1#9.18 U1#10.18 U1#11.18 U1#12.18 U1#13.18 U1#14.18 U1#15.18 U1#16.18 U1#17.18 U1#18.18 U1#19.18 U1#20.18 U1#21.18 U1#22.18 U1#23.18 U1#24.18 U1#25.18 U1#26.18 U1#27.18 U1#28.18 U1#29.18 U1#30.18 U1#31.18 U1#32.18 U2.4 U2#2.4 U2#3.4 U2#4.4 U2#5.4 U2#6.4 U2#7.4 U2#8.4 U2#9.4 U2#10.4 U2#11.4 U2#12.4 U2#13.4 U2#14.4 U2#15.4 U2#16.4 U2#17.4 U2#18.4 U2#19.4 U2#20.4 U2#21.4 U2#22.4 U2#23.4 U2#24.4 U2#25.4 U2#26.4 U2#27.4 U2#28.4 U2#29.4 U2#30.4 U2#31.4 U2#32.4
